# EAGLE design ionode_sunb (EAGLE 7.7.0)
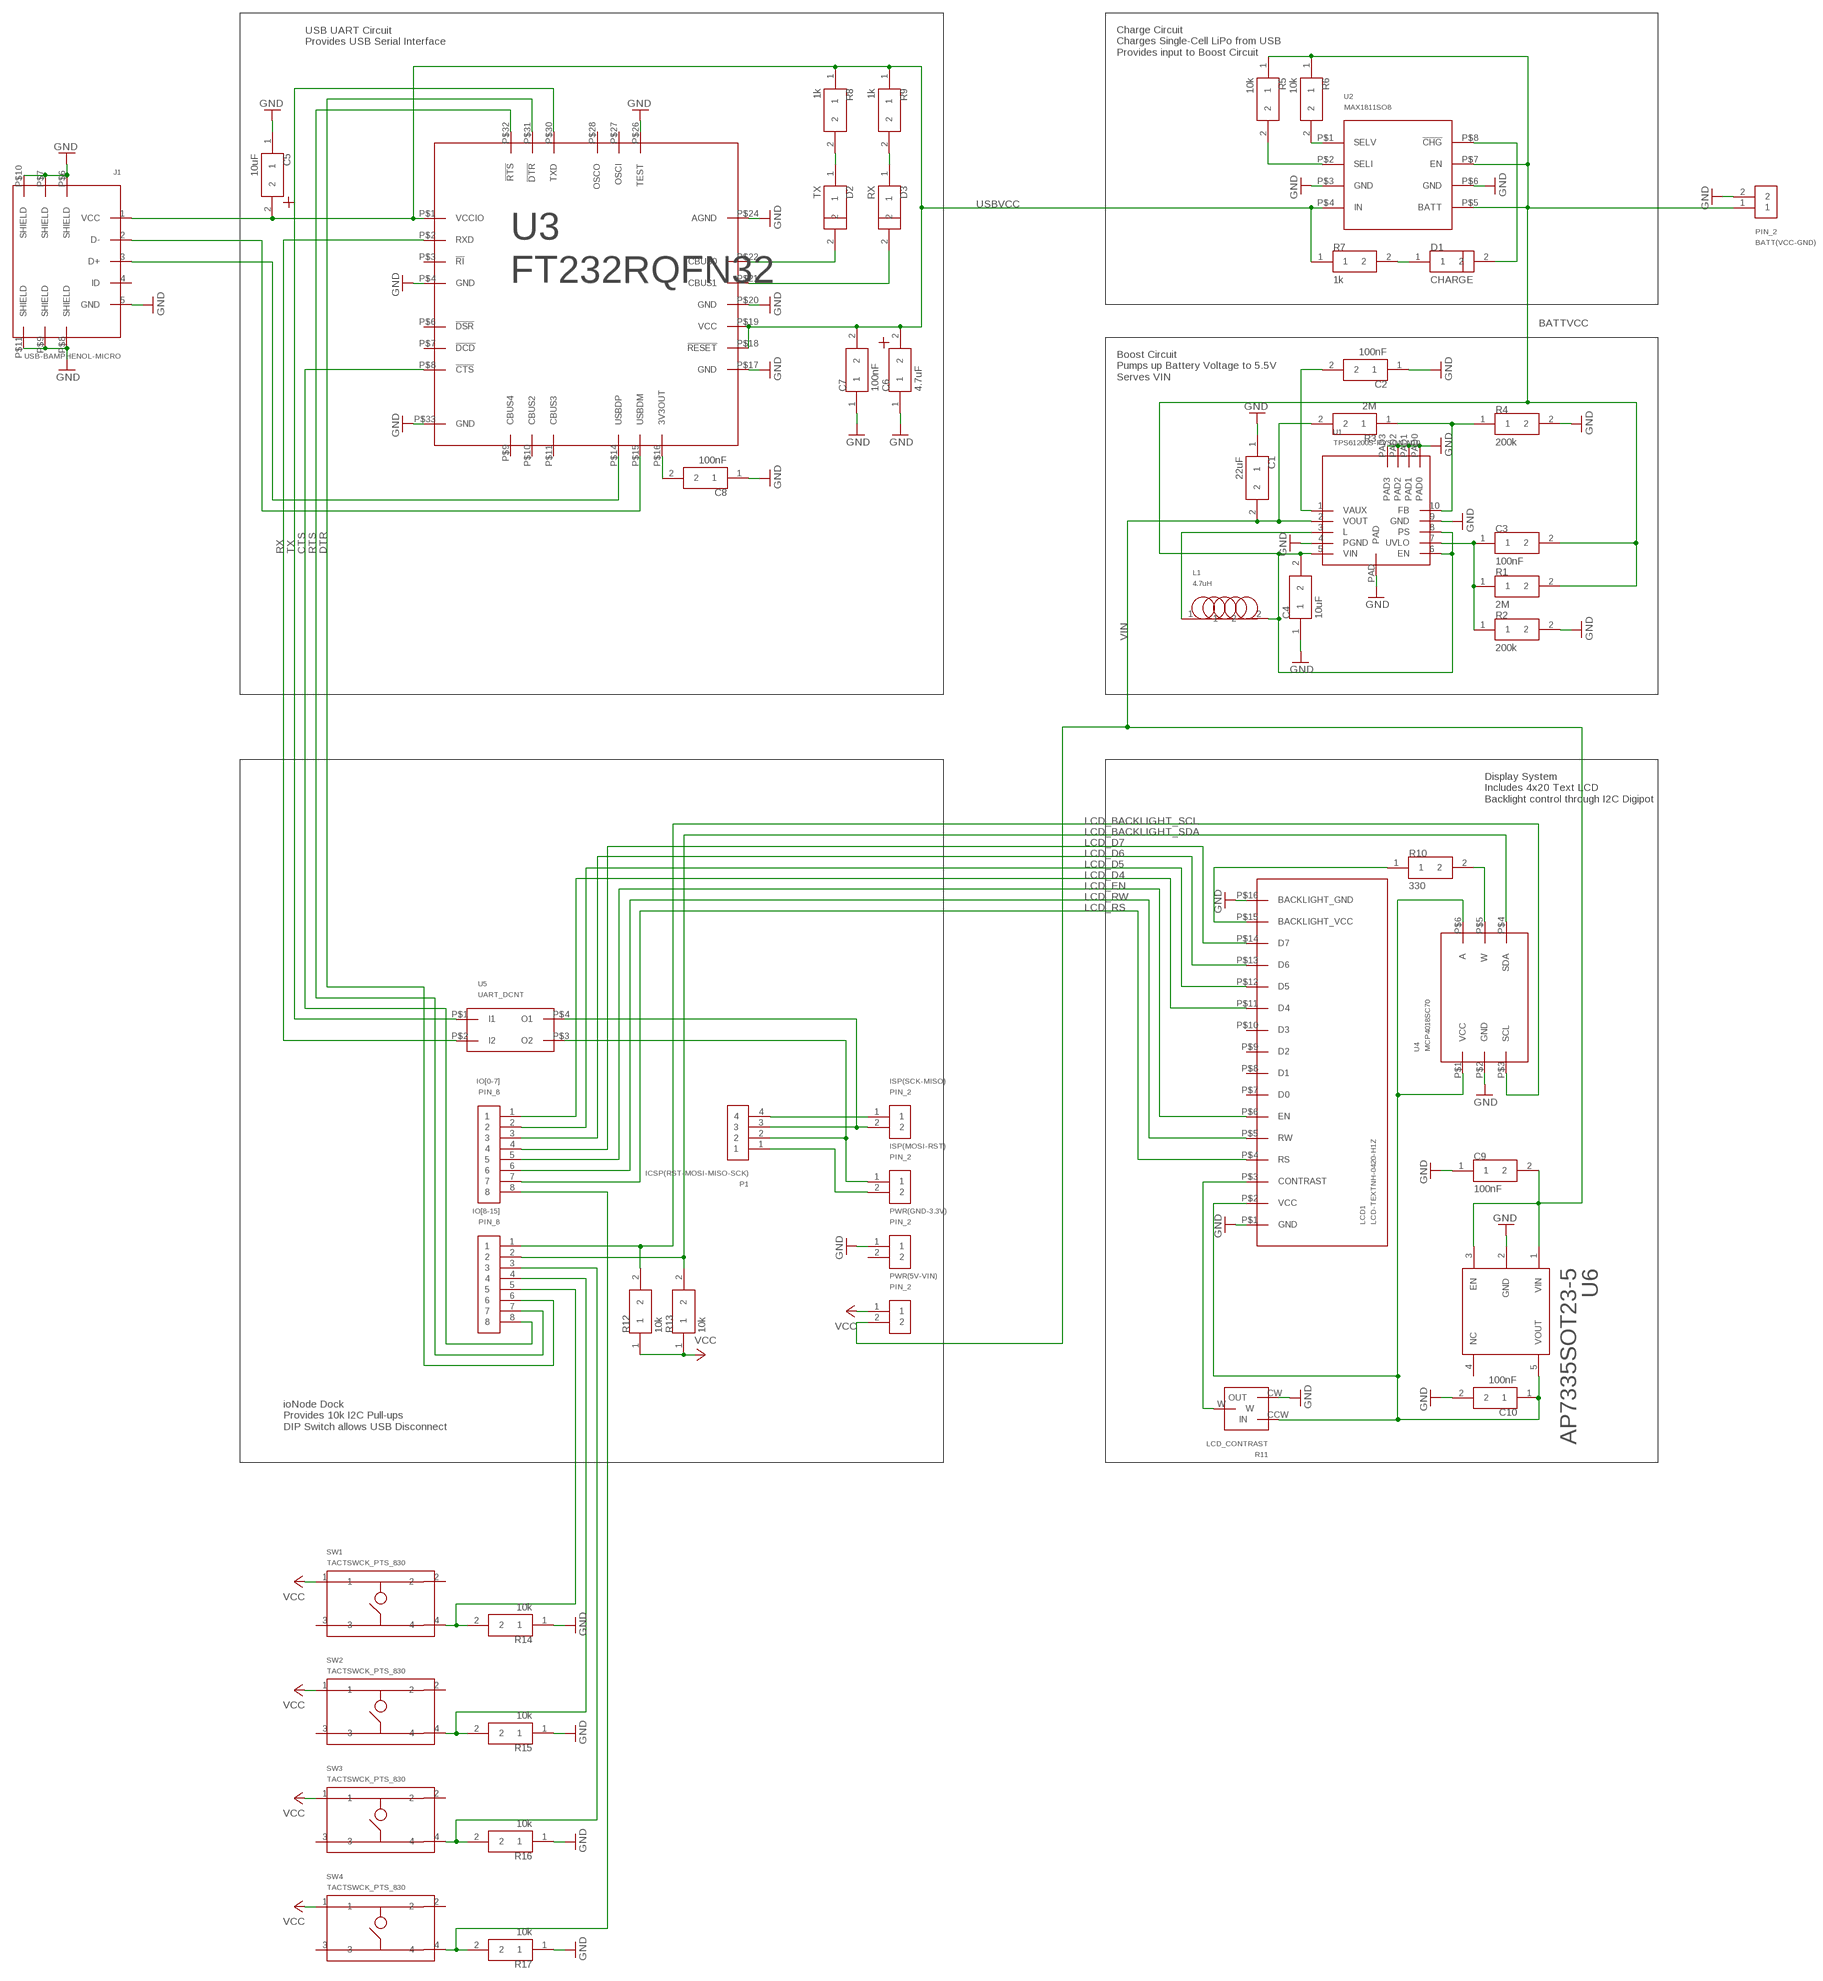
[diagram p0: schematic, sheet 1]

## Parts
BATT(VCC-GND)  PIN_2  [PIN_2]
C1  22uF  CAP1206  [1206]
C2  100nF  CAP0805  [0805]
C3  100nF  CAP0805  [0805]
C4  10uF  CAP0805  [0805]
C5  10uF  CAP_POLARIZEDSMD_RADIAL_43  [RADCAP_SMD_43]
C6  4.7uF  CAP_POLARIZEDSMD_RADIAL_43  [RADCAP_SMD_43]
C7  100nF  CAP0805  [0805]
C8  100nF  CAP0805  [0805]
C9  100nF  CAP0805  [0805]
C10  100nF  CAP0805  [0805]
D1  CHARGE  LED0805  [0805]
D2  TX  LED0805  [0805]
D3  RX  LED0805  [0805]
IO[0-7]  PIN_8  [PIN_8]
IO[8-15]  PIN_8  [PIN_8]
ISP(MOSI-RST)  PIN_2  [PIN_2]
ISP(SCK-MISO)  PIN_2  [PIN_2]
J1  USB-BAMPHENOL-MICRO  [AMPHENOL-USB-MICRO-B]
L1  4.7uH  INDSMD-3232  [IND-SMD-3232]
LCD1  LCD-TEXTNH-0420-H1Z  [LCD-NH-0420-H1Z]
P1  ICSP(RST-MOSI-MISO-SCK)  PIN_4  [PIN_4]
PWR(5V-VIN)  PIN_2  [PIN_2]
PWR(GND-3.3V)  PIN_2  [PIN_2]
R1  2M  RES0805  [0805]
R2  200k  RES0805  [0805]
R3  2M  RES0805  [0805]
R4  200k  RES0805  [0805]
R5  10k  RES0805  [0805]
R6  10k  RES0805  [0805]
R7  1k  RES0805  [0805]
R8  1k  RES0805  [0805]
R9  1k  RES0805  [0805]
R10  330  RES0805  [0805]
R11  LCD_CONTRAST  TRIMPOTBOURNS-3306F  [TRIMPOT-BOURNS-3306F]
R12  10k  RES0805  [0805]
R13  10k  RES0805  [0805]
R14  10k  RES0805  [0805]
R15  10k  RES0805  [0805]
R16  10k  RES0805  [0805]
R17  10k  RES0805  [0805]
SW1  TACTSWCK_PTS_830  [TACTSW_CK_PTS_830]
SW2  TACTSWCK_PTS_830  [TACTSW_CK_PTS_830]
SW3  TACTSWCK_PTS_830  [TACTSW_CK_PTS_830]
SW4  TACTSWCK_PTS_830  [TACTSW_CK_PTS_830]
U1  TPS61200S-PVSON-N10  [S-PVSON-N10]
U2  MAX1811SO8  [SO8]
U3  FT232RQFN32  [32-VQFN]
U4  MCP4018SC70  [SC-70]
U5  UART_DCNT  DIPSWITCH_2DIP  [DIPSWITCH_2]
U6  AP7335SOT23-5  [SOT23-5]

## Nets
BATTVCC: BATT(VCC-GND).1 C3.2 C4.2 L1.2 R1.2 R5.1 R6.1 U1.5(VIN) U1.6(EN) U1.8(PS) U2.P$5(BATT) U2.P$7(EN)
CTS: IO[8-15].8 U3.P$8(!CTS)
DTR: IO[8-15].6 U3.P$31(!DTR)
GND: BATT(VCC-GND).2 C1.1 C2.1 C4.1 C5.1 C6.1 C7.1 C8.1 C9.1 C10.2 J1.5(GND) J1.P$6(SHIELD) J1.P$7(SHIELD) J1.P$8(SHIELD) J1.P$9(SHIELD) J1.P$10(SHIELD) J1.P$11(SHIELD) LCD1.P$1(GND) LCD1.P$16(BACKLIGHT_GND) R2.2 R4.2 R11.CW(OUT) R14.1 R15.1 R16.1 R17.1 U1.4(PGND) U1.9(GND) U1.PAD U1.PAD0 U1.PAD1 U1.PAD2 U1.PAD3 U2.P$3(GND) U2.P$6(GND) U3.P$4(GND) U3.P$17(GND) U3.P$20(GND) U3.P$24(AGND) U3.P$26(TEST) U3.P$33(GND) U4.P$2(GND) U6.2(GND)
LCD_BACKLIGHT_SCL: IO[8-15].1 R12.2 U4.P$3(SCL)
LCD_BACKLIGHT_SDA: IO[8-15].2 R13.2 U4.P$4(SDA)
LCD_D4: IO[0-7].1 LCD1.P$11(D4)
LCD_D5: IO[0-7].2 LCD1.P$12(D5)
LCD_D6: IO[0-7].3 LCD1.P$13(D6)
LCD_D7: IO[0-7].4 LCD1.P$14(D7)
LCD_EN: IO[0-7].5 LCD1.P$6(EN)
LCD_RS: IO[0-7].7 LCD1.P$4(RS)
LCD_RW: IO[0-7].6 LCD1.P$5(RW)
LCDVCC: C10.1 LCD1.P$2(VCC) R11.CCW(IN) U4.P$1(VCC) U4.P$6(A) U6.5(VOUT)
N$1: ISP(MOSI-RST).1 P1.2 U5.P$3(O2)
N$2: R6.2 U2.P$1(SELV)
N$3: R3.1 R4.1 U1.10(FB)
N$4: C2.2 U1.1(VAUX)
N$5: L1.1 U1.3(L)
N$6: C3.1 R1.1 R2.1 U1.7(UVLO)
N$7: R10.2 U4.P$5(W)
N$8: R5.2 U2.P$2(SELI)
N$9: LCD1.P$15(BACKLIGHT_VCC) R10.1
N$10: D1.2 U2.P$8(!CHG)
N$11: D1.1 R7.2
N$12: LCD1.P$3(CONTRAST) R11.W
N$13: J1.2(D-) U3.P$15(USBDM)
N$14: J1.3(D+) U3.P$14(USBDP)
N$15: C8.2 U3.P$16(3V3OUT)
N$16: ISP(SCK-MISO).2 P1.3 U5.P$4(O1)
N$17: D2.2 U3.P$22(CBUS0)
N$18: D3.2 U3.P$21(CBUS1)
N$19: D2.1 R8.2
N$20: D3.1 R9.2
N$21: IO[8-15].5 R14.2 SW1.4
N$22: IO[8-15].4 R15.2 SW2.4
N$23: IO[8-15].3 R16.2 SW3.4
N$24: IO[0-7].8 R17.2 SW4.4
N$25: ISP(SCK-MISO).1 P1.4
N$26: ISP(MOSI-RST).2 P1.1
RTS: IO[8-15].7 U3.P$32(!RTS)
RX: U3.P$2(RXD) U5.P$2(I2)
TX: U3.P$30(TXD) U5.P$1(I1)
USBVCC: C5.2 C6.2 C7.2 J1.1(VCC) R7.1 R8.1 R9.1 U2.P$4(IN) U3.P$1(VCCIO) U3.P$18(!RESET) U3.P$19(VCC)
VCC: PWR(5V-VIN).1 R12.1 R13.1 SW1.1 SW2.1 SW3.1 SW4.1
VIN: C1.2 C9.2 PWR(5V-VIN).2 R3.2 U1.2(VOUT) U6.1(VIN) U6.3(EN)
Unconnected: J1.4(ID) LCD1.P$7(D0) LCD1.P$8(D1) LCD1.P$9(D2) LCD1.P$10(D3) PWR(GND-3.3V).1 PWR(GND-3.3V).2 SW1.2 SW1.3 SW2.2 SW2.3 SW3.2 SW3.3 SW4.2 SW4.3 U3.P$3(!RI) U3.P$6(!DSR) U3.P$7(!DCD) U3.P$9(CBUS4) U3.P$10(CBUS2) U3.P$11(CBUS3) U3.P$27(OSCI) U3.P$28(OSCO) U6.4(NC)

## Notes on the sheet
- USB UART Circuit
  Provides USB Serial Interface
- Charge Circuit
  Charges Single-Cell LiPo from USB
  Provides input to Boost Circuit
- Boost Circuit
  Pumps up Battery Voltage to 5.5V
  Serves VIN
- Display System
  Includes 4x20 Text LCD
  Backlight control through I2C Digipot
- ioNode Dock
  Provides 10k I2C Pull-ups
  DIP Switch allows USB Disconnect

## Library data of the parts
BATT(VCC-GND) ISP(MOSI-RST) ISP(SCK-MISO) PWR(5V-VIN) PWR(GND-3.3V) = dooba:PIN_2
C1-C4 C7-C10 = dooba:CAP
C5 C6 = dooba:CAP_POLARIZED
D1-D3 = dooba:LED
IO[0-7] IO[8-15] = dooba:PIN_8
J1 = dooba:USB-B
L1 = dooba:IND
LCD1 = dooba:LCD-TEXT
P1 = dooba:PIN_4
R1-R10 R12-R17 = dooba:RES
R11 = dooba:TRIMPOT
SW1-SW4 = dooba:TACTSW
U1 = dooba:TPS61200
U2 = dooba:MAX1811
U3 = dooba:FT232R
U4 = dooba:MCP4018
U5 = dooba:DIPSWITCH_2
U6 = dooba:AP7335

## Board
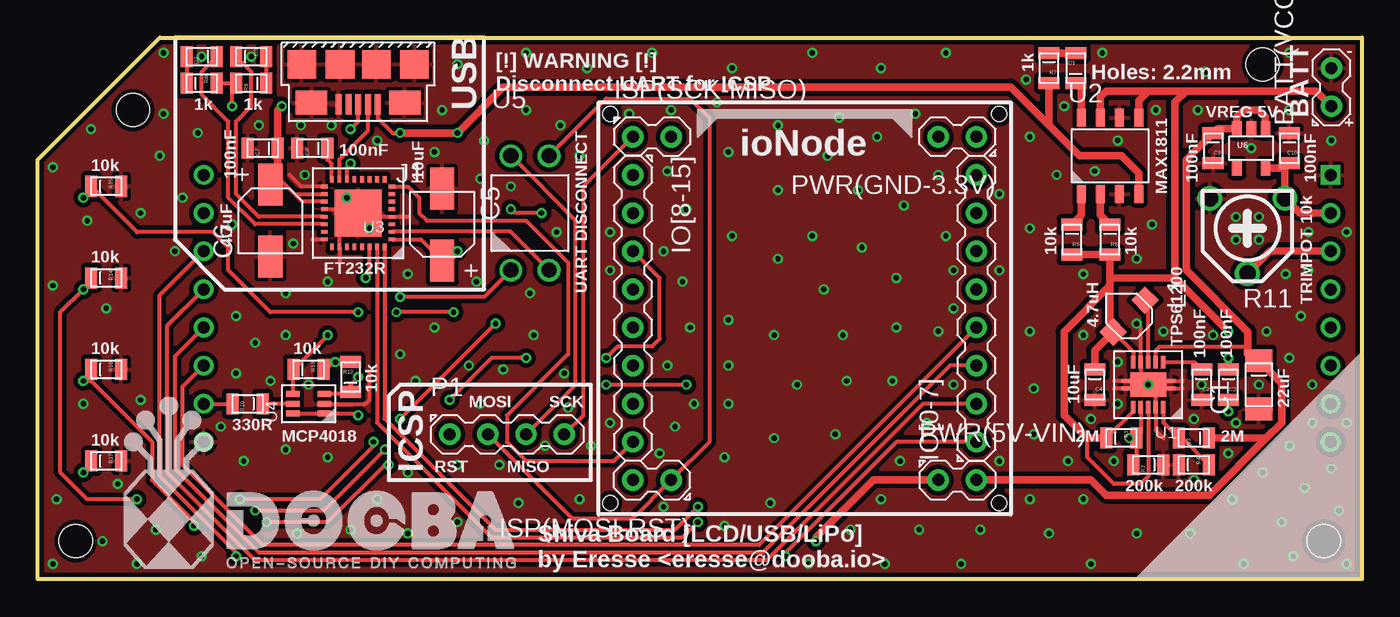
[diagram p1: board, top side]
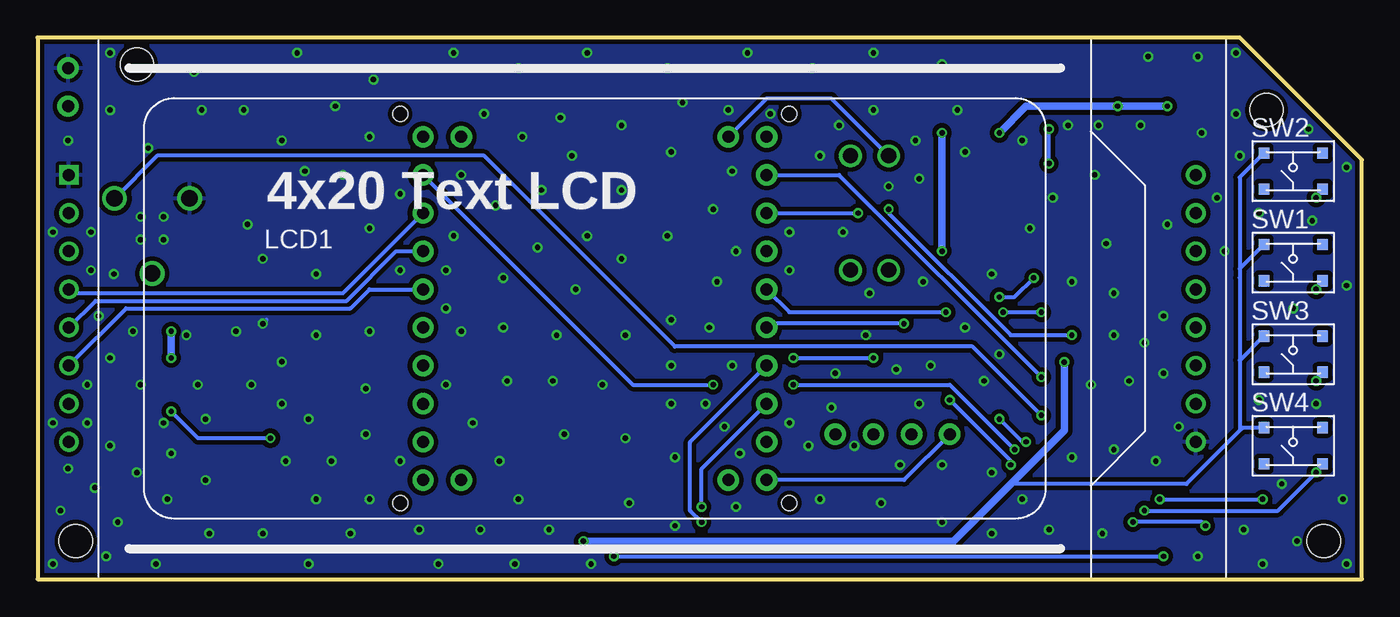
[diagram p2: board, bottom side, seen from below]

Size 88.14 x 36.07 mm. Coordinates in mm from the lower left corner, seen from the top.
Outline: 0,0 0,27.94 8.13,36.07 88.14,36.07 88.14,0 0,0
Copper layers (1*16): Top 0.035mm / dielectric 1.5mm / Bottom 0.035mm
Design rules "dooba *": minimum track width 6mil, minimum drill 12mil, track to track 6mil, track to pad 6mil, pad to pad 6mil, via to via 6mil, smd to smd 0mil, copper to edge 10mil, drill to drill 10mil, minimum pad ring 10mil, minimum via ring 6mil, stop-mask expansion 2mil, vias tented up to drill 25mil, thermal gap 10mil
Holes 1 mm at 64.01,5.08 38.1,5.08 64.01,30.99 38.1,30.99
Holes 2.2 mm at 6.35,31.24 2.54,2.54 85.6,2.54 81.53,34.29

### Footprints (pad centres in the part's own frame; a part is rotated, then mirrored left to right if it is on the bottom)
PIN_2 = drill 0.8 pad 1.422: 1 -1.27,0; 2 1.27,0
1206 = smd 1.524 x 1.778: 1 -1.6,0; 2 1.6,0
0805 = smd 0.8 x 1.4: 1 -1,0; 2 1,0
RADCAP_SMD_43 = smd 2.8 x 1.6: 1 -2.4,0; 2 2.4,0
PIN_8 = drill 0.8 pad 1.422: 1 -8.89,0; 2 -6.35,0; 3 -3.81,0; 4 -1.27,0; 5 1.27,0; 6 3.81,0; 7 6.35,0; 8 8.89,0
AMPHENOL-USB-MICRO-B = smd 0.4 x 1.35: 1 -1.3,2.675; 2 -0.65,2.675; 3 0,2.675; 4 0.65,2.675; 5 1.3,2.675 | smd 1.9 x 1.9: P$6 -1.2,0; P$7 1.2,0; P$8 -3.75,0; P$9 3.75,0 | smd 2.1 x 1.6: P$10 -3.1,2.55; P$11 3.1,2.55
IND-SMD-3232 = smd 1.3 x 1.3 rotated 315: 1 -1.061,1.061; 2 1.061,-1.061
LCD-NH-0420-H1Z = drill 0.8 square: P$1 -35,8.89 | drill 0.8: P$2 -35,6.35; P$3 -35,3.81; P$4 -35,1.27; P$5 -35,-1.27; P$6 -35,-3.81; P$7 -35,-6.35; P$8 -35,-8.89; P$9 40,8.89; P$10 40,6.35; P$11 40,3.81; P$12 40,1.27; P$13 40,-1.27; P$14 40,-3.81; P$15 40,-6.35; P$16 40,-8.89
PIN_4 = drill 0.8 pad 1.422: 1 -3.81,0; 2 -1.27,0; 3 1.27,0; 4 3.81,0
TRIMPOT-BOURNS-3306F = drill 1.1: CCW -2.5,-2.5; CW 2.5,-2.5; W 0,2.5
TACTSW_CK_PTS_830 = smd 0.7 x 0.75: 1 -1.95,1.2; 2 1.95,1.2; 3 -1.95,-1.2; 4 1.95,-1.2
S-PVSON-N10 = smd 0.3 x 0.85: 1 -1,-1.5; 2 -0.5,-1.5; 3 0,-1.5; 4 0.5,-1.5; 5 1,-1.5; 6 1,1.5; 7 0.5,1.5; 8 0,1.5; 9 -0.5,1.5; 10 -1,1.5 | smd 2.4 x 1.65: PAD 0,0 | smd 0.6 x 0.28: PAD0 -1.499,0.25; PAD1 -1.499,-0.25; PAD2 1.499,0.25; PAD3 1.499,-0.25
SO8 = smd 0.6 x 1.2: P$1 -1.905,-2.54; P$2 -0.635,-2.54; P$3 0.635,-2.54; P$4 1.905,-2.54; P$5 1.905,2.54; P$6 0.635,2.54; P$7 -0.635,2.54; P$8 -1.905,2.54
32-VQFN = smd 0.45 x 0.26: P$1 -2.25,1.75; P$2 -2.25,1.25; P$3 -2.25,0.75; P$4 -2.25,0.25; P$5 -2.25,-0.25; P$6 -2.25,-0.75; P$7 -2.25,-1.25; P$8 -2.25,-1.75; P$17 2.25,-1.75; P$18 2.25,-1.25; P$19 2.25,-0.75; P$20 2.25,-0.25; P$21 2.25,0.25; P$22 2.25,0.75; P$23 2.25,1.25; P$24 2.25,1.75 | smd 0.26 x 0.45: P$9 -1.75,-2.25; P$10 -1.25,-2.25; P$11 -0.75,-2.25; P$12 -0.25,-2.25; P$13 0.25,-2.25; P$14 0.75,-2.25; P$15 1.25,-2.25; P$16 1.75,-2.25; P$25 1.75,2.25; P$26 1.25,2.25; P$27 0.75,2.25; P$28 0.25,2.25; P$29 -0.25,2.25; P$30 -0.75,2.25; P$31 -1.25,2.25; P$32 -1.75,2.25 | smd 3.1 x 3.1: P$33 0,0
SC-70 = smd 0.4 x 0.9: P$1 -0.65,-1.05; P$2 0,-1.05; P$3 0.65,-1.05; P$4 0.65,1.05; P$5 0,1.05; P$6 -0.65,1.05
DIPSWITCH_2 = drill 1: P$1 -1.27,-3.81; P$2 1.27,-3.81; P$3 1.27,3.81; P$4 -1.27,3.81
SOT23-5 = smd 0.66 x 1: 1 0.95,1.315; 2 0,1.315; 3 -0.95,1.315; 4 -0.95,-1.315; 5 0.95,-1.315

### Placement (x,y rotation side)
BATT(VCC-GND)  86.11,32.77 90 top
C1  81.28,12.95 90 top
C2  77.47,12.95 90 top
C3  79.25,12.95 90 top
C4  70.36,12.95 90 top
C5  26.92,23.62 270 top
C6  15.49,23.88 90 top
C7  14.99,28.7 0 top
C8  18.29,28.7 0 top
C9  78.23,28.7 90 top
C10  83.31,28.7 90 top
D1  69.09,34.04 270 top
D2  10.92,34.8 0 top
D3  14.22,34.8 180 top
IO[0-7]  62.48,18.03 90 top
IO[8-15]  39.62,18.03 270 top
ISP(MOSI-RST)  40.89,6.6 180 top
ISP(SCK-MISO)  40.89,29.46 0 top
J1  21.34,34.29 180 top
L1  72.64,17.53 270 top
LCD1  51.05,18.03 0 bottom
P1  31.24,9.65 0 top
PWR(5V-VIN)  61.21,6.6 0 top
PWR(GND-3.3V)  61.21,29.46 180 top
R1  72.14,9.4 180 top
R2  73.91,7.62 0 top
R3  76.96,9.4 0 top
R4  76.96,7.62 180 top
R5  71.37,22.61 90 top
R6  68.83,22.61 90 top
R7  67.31,34.04 90 top
R8  10.92,33.02 180 top
R9  14.22,33.02 0 top
R10  13.97,11.68 0 top
R11  80.52,22.86 180 top
R12  20.83,13.46 270 top
R13  18.03,13.97 180 top
R14  4.57,20.07 180 top
R15  4.57,26.16 180 top
R16  4.57,13.97 180 top
R17  4.57,7.87 180 top
SW1  4.57,21.08 0 bottom
SW2  4.57,27.18 0 bottom
SW3  4.57,14.99 0 bottom
SW4  4.57,8.89 0 bottom
U1  73.91,12.95 180 top
U2  71.37,28.19 0 top
U3  21.34,24.38 180 top
U4  18.03,11.68 90 top
U5  32.77,24.38 0 top
U6  80.77,28.7 0 top

### Tracks (layer width: path | path; a pad name or v marks a point on that pad's centre or on a via)
BATTVCC  (via drill 0.36)
  Top 0.254: L1.2 72.91,15.13 U1.5 | U1.8 73.91,6.86 73.41,6.35 71.63,6.35 69.85,8.13 69.85,9.4 | U1.6 72.91,11.18 R1.2
  Top 0.508: U2.P$7 70.74,32.13 71.12,32.51 73.91,32.51 | U2.P$5 73.28,31.88 73.91,32.51 | R6.1 R5.1 71.37,20.07 | 71.37,20.07 71.37,19.56 | 71.37,19.56 71.37,16.67 L1.2 70.36,15.24 C4.2 | 71.37,19.56 68.33,16.51 68.33,10.92 69.85,9.4 R1.2 | C3.2 v79.25,14.73 | v79.25,16.51 75.69,20.07 | 75.69,20.07 71.37,20.07 | 73.91,32.51 76.45,32.51 | 76.45,32.51 85.09,32.51 BATT(VCC-GND).1 | 75.69,20.07 75.69,31.75 76.45,32.51
  Bottom 0.508: v79.25,14.73 v79.25,16.51
CTS
  Top 0.254: U3.P$8 24.67,26.13 25.4,25.4 25.4,24.38 25.91,23.88 32.51,23.88 35.31,21.08 35.31,14.99 31.24,10.92 31.24,9.14 32.51,7.87 38.35,7.87 IO[8-15].8
DTR  (via drill 0.36)
  Top 0.254: U3.P$31 22.59,10.43 30.23,2.79 42.93,2.79 v43.94,3.81
  Bottom 0.254: v43.94,3.81 44.7,4.57 44.7,9.14 IO[8-15].6
GND  (via drill 0.36)
  Top 0.254: 74.41,12.45 U1.9 74.41,9.91 74.93,9.4 | 74.41,12.45 U1.PAD | 76.2,12.7 U1.PAD0 74.66,12.7 74.41,12.45 | U1.PAD1 76.2,13.2 76.2,13.21 | U1.PAD3 71.63,13.2 71.63,13.21 | 71.63,12.7 U1.PAD2 73.66,12.7 U1.PAD | U1.PAD 73.41,13.45 U1.4 73.41,16.76 v73.15,17.02 | U3.P$20 20.07,24.63 | 20.07,24.63 21.34,24.63 21.84,24.13 21.85,24.13 U3.P$4 24.63,24.13 24.64,24.13 | U3.P$33 20.09,23.13 U3.P$26 20.09,21.1 20.07,21.08 | 20.07,25.65 20.07,24.63 | U3.P$17 17.55,26.13 16.76,26.92 | U3.P$24 18.32,22.63 18.29,22.61 | U4.P$2 21.84,11.68 22.1,11.94 22.1,13.72
  Bottom 0.254: v73.15,17.02 72.9,17.27
  other vias: 8.38,35.05 1.02,27.43 1.02,1.02 87.12,1.02 8.38,30.99 3.56,29.97 10.67,29.72 4.57,18.03 9.14,21.84 12.95,23.62 16.51,19.05 19.3,19.81 24.64,20.32 29.21,19.81 32.77,19.05 26.42,16.76 25.15,13.21 28.7,14.22 30.99,13.97 16.51,16.26 19.3,8.13 16.51,8.64 13.72,7.87 13.21,13.72 13.21,17.53 6.86,11.94 3.05,11.68 5.33,6.35 6.86,24.38 3.3,23.88 1.02,19.56 8.13,28.19 9.65,25.4 17.02,22.35 1.27,5.33 4.32,2.54 10.92,1.52 17.27,3.05 20.83,3.3 24.64,3.05 22.61,5.33 24.64,7.11 27.94,3.81 27.94,7.62 32,5.08 30.73,7.62 36.07,5.33 41.4,8.38 41.66,4.83 45.72,3.56 48.77,5.08 45.72,8.13 38.1,10.41 29.46,11.68 35.31,11.43 33.78,8.89 36.83,8.89 35.05,13.72 33.02,16.26 17.78,26.92 20.57,25.4 22.1,23.37 14.73,30.23 17.53,30.23 19.56,30.23 22.61,29.21 26.42,28.45 29.46,26.67 31.5,26.16 29.72,29.21 32.51,31.24 26.92,31.24 14.22,34.8 10.92,34.8 27.94,34.29 34.8,30.23 36.07,28.19 39.37,30.99 41.91,27.18 42.16,31.24 32.51,35.05 40.89,35.05 38.1,23.11 38.1,20.57 34.54,23.11 41.91,14.22 43.43,16.76 41.66,21.84 43.18,24.64 42.93,19.81 45.97,17.27 45.97,28.45 46.23,22.86 49.28,25.91 49.28,21.34 51.56,22.86 54.61,25.91 52.58,28.19 55.88,29.46 49.28,30.23 59.94,26.92 57.66,24.89 54.86,22.1 52.32,19.3 49.02,16.26 45.97,14.22 42.42,10.16 43.69,11.68 45.97,11.68 60.45,22.86 60.96,20.57 60.96,18.03 59.94,16.51 56.9,13.21 53.09,9.65 49.02,9.4 50.55,12.95 53.59,16.26 57.15,20.07 57.15,16.76 53.85,13.21 59.18,10.41 60.96,12.95 57.4,7.87 56.13,5.33 54.1,3.3 51.31,1.02 58.67,3.3 56.39,1.02 61.47,1.02 62.74,3.3 67.31,3.05 70.1,1.02 73.15,3.05 68.58,7.87 64.01,7.87 66.29,12.7 66.29,9.65 66.04,16.51 64.01,20.57 67.82,26.92 66.04,23.37 69.6,20.32 73.15,21.34 74.17,23.62 74.42,31.24 71.88,29.21 70.36,27.18 66.04,29.46 58.42,30.99 53.34,30.73 45.21,31.75 51.56,35.05 60.45,35.05 65.79,33.27 68.33,31.5 70.87,35.05 83.31,35.05 77.72,33.78 56.13,34.04 46.23,34.04 36.58,34.04 77.22,31.24 83.31,31.24 86.11,29.21 81.28,22.61 79.76,24.13 79.76,22.61 81.28,24.13 84.58,23.11 87.12,23.11 74.93,16.51 78.23,16.26 81.79,16.51 83.31,14.73 84.84,12.95 84.84,10.41 83.31,8.89 76.96,10.67 70.1,10.67 71.88,11.68 71.88,14.48 69.6,16.26 71.63,7.87 76.96,6.6 79.25,8.38 79.76,10.41 81.28,12.95 77.47,12.95 73.91,12.95 69.6,5.33 66.04,5.33 79.5,5.33 81.53,7.11 83.06,20.32 84.58,20.57 84.07,17.53 87.12,10.41 86.11,7.37 86.61,4.57 82.8,3.81 76.71,3.05 80.26,1.02 83.57,1.52 84.33,6.1 7.87,3.3 6.6,1.02 14.48,15.75 24.13,14.99 18.03,12.95 15.49,13.21 12.19,10.16 64.01,25.65 80.77,28.7
  pour Top (isolate 0.305): 0,27.94 8.13,36.07 88.14,36.07 88.14,0 0,0
  pour Bottom (isolate 0.305): 8.13,36.07 88.14,36.07 88.14,0 0,0 0,27.94
LCD_BACKLIGHT_SCL  (via drill 0.36)
  Top 0.254: v21.34,13.46 20.83,12.95 R12.2 20.7,12.33 U4.P$3
  Bottom 0.254: IO[8-15].1 34.8,26.92 v21.34,13.46
LCD_BACKLIGHT_SDA  (via drill 0.36)
  Top 0.254: v33.53,24.38 31.75,24.38 v31.5,24.64 | v19.3,16.26 19.3,16.24 R13.2 16.98,13.92 U4.P$4
  Bottom 0.254: IO[8-15].2 v33.53,24.38 | v31.5,24.64 31.5,24.38 23.37,16.26 v19.3,16.26
LCD_D4  (via drill 0.36)
  Top 0.254: IO[0-7].1 57.15,9.14 49.78,1.78 v49.78,1.52 | v13.21,1.52 13.21,1.78 8.13,6.86 8.13,18.92 LCD1.P$11
  Bottom 0.254: v49.78,1.52 v13.21,1.52
LCD_D5
  Top 0.254: IO[0-7].2 58.93,11.68 48.51,1.27 14.48,1.27 8.64,7.11 8.64,16.89 LCD1.P$12
LCD_D6
  Top 0.254: IO[0-7].3 60.71,14.22 48.26,1.78 14.73,1.78 9.14,7.37 9.14,14.85 LCD1.P$13
LCD_D7
  Top 0.254: IO[0-7].4 48.01,2.29 14.99,2.29 9.65,7.62 9.65,12.82 LCD1.P$14
LCD_EN
  Bottom 0.254: LCD1.P$6 82.24,18.03 67.31,18.03 66.04,19.3 IO[0-7].5
LCD_RS
  Bottom 0.254: IO[0-7].7 67.82,19.05 85.8,19.05 LCD1.P$4
LCD_RW
  Bottom 0.254: LCD1.P$5 84.28,18.54 67.56,18.54 64.26,21.84 IO[0-7].6
LCDVCC  (via drill 0.36)
  Top 0.254: U4.P$6 U4.P$1 21.22,11.03 v21.34,10.92
  Top 0.508: C10.1 83,27.39 | 83,27.39 U6.5 | 83,27.39 83.02,27.37 R11.CCW 83.99,24.38 LCD1.P$2
  Bottom 0.254: v21.34,10.92 25.91,15.49 45.72,15.49 58.42,28.19 80.18,28.19 R11.CCW
N$1
  Top 0.254: U5.P$3 37.85,32 43.43,32 44.7,30.73 44.7,9.14 ISP(MOSI-RST).1 39.62,4.06 35.56,4.06 P1.2
N$2
  Top 0.508: U2.P$1 69.47,24.24 R6.2
N$3
  Top 0.254: U1.10 74.91,10.45 R3.1 76.18,9.4 R4.1
N$4
  Top 0.254: U1.1 76.97,14.45 C2.2
N$5
  Top 0.254: U1.3 73.91,18.38 L1.1
N$6  (via drill 0.36)
  Top 0.254: U1.7 73.41,9.68 R1.1 | R1.1 73.14,7.84 R2.1 | C3.1 v79.25,11.18 | v72.64,9.4 R1.1
  Bottom 0.254: v79.25,11.18 77.47,9.4 v72.64,9.4
N$7
  Top 0.254: U4.P$5 R10.2
N$8
  Top 0.508: U2.P$2 70.74,24.24 R5.2
N$9
  Top 0.254: LCD1.P$15 R10.1
N$10
  Top 0.508: U2.P$8 69.47,32.66 D1.2
N$11
  Top 0.508: R7.2 D1.1
N$12
  Top 0.508: LCD1.P$3 82,21.84 R11.W
N$13
  Top 0.254: U3.P$15 20.09,27.96 21.99,29.86 J1.2
N$14  (via drill 0.36)
  Top 0.254: U3.P$14 20.59,27.44 v20.83,27.69 | v20.83,29.97 21.34,30.48 J1.3
  Bottom 0.254: v20.83,27.69 v20.83,29.97
N$15
  Top 0.254: U3.P$16 19.59,27.66 19.3,27.94 19.3,28.69 C8.2
N$16
  Top 0.254: U5.P$4 35.81,23.88 35.81,12.95 P1.3
  Bottom 0.254: U5.P$4 35.31,32 39.62,32 ISP(SCK-MISO).2
N$17
  Top 0.254: U3.P$22 14.47,23.63 12.7,25.4 12.7,30.48 10.92,32.26 10.92,33.78 11.92,34.78 D2.2
N$18
  Top 0.254: U3.P$21 14.73,24.13 13.21,25.65 13.21,30.48 14.22,31.5 14.22,33.78 13.22,34.78 D3.2
N$19
  Top 0.254: D2.1 R8.2
N$20
  Top 0.254: D3.1 R9.2
N$21  (via drill 0.36)
  Top 0.254: R14.2 3.57,19.83 v3.05,19.3 1.52,17.78 1.52,7.11 3.3,5.33 v6.6,5.33 | v30.48,17.02 v24.13,10.67 | v13.46,5.33 18.8,5.33 22.35,8.89 v22.35,9.14
  Bottom 0.254: SW1.4 3.05,19.46 v3.05,19.3 | v13.46,5.33 v6.6,5.33 | v24.13,10.67 22.61,9.14 v22.35,9.14 | v30.48,17.02 39.37,17.02 IO[8-15].5
N$22  (via drill 0.36)
  Top 0.254: v3.05,25.4 3.57,25.92 R15.2 6.62,23.11 11.68,23.11 12.7,22.1 12.7,20.57 15.49,17.78 v21.34,17.78 | v27.69,17.78 v23.88,17.78
  Bottom 0.254: SW2.4 3.05,25.55 v3.05,25.4 | IO[8-15].4 38.1,17.78 v27.69,17.78 | v23.88,17.78 v21.34,17.78
N$23  (via drill 0.36)
  Top 0.254: R16.2 3.57,13.73 v3.05,13.21 3.56,13.21 7.62,9.14 7.62,6.6 10.41,3.81 v10.41,3.56 | v15.24,3.81 19.3,3.81 23.11,7.62 v23.37,7.62 | v27.43,11.94 30.23,14.73 v32.51,14.73 | IO[8-15].3 41.4,20.07 41.4,16 40.89,15.49 38.61,15.49 v37.85,14.73
  Bottom 0.254: SW3.4 3.05,13.36 v3.05,13.21 | v10.41,3.56 10.67,3.81 v15.24,3.81 | v23.37,7.62 23.37,7.87 v27.43,11.94 | v37.85,14.73 v32.51,14.73
N$24  (via drill 0.36)
  Top 0.254: v3.05,7.11 3.57,7.64 R17.2 | v43.18,12.95 v37.85,12.95 | v23.11,8.64 19.05,4.57 v14.48,4.57
  Bottom 0.254: SW4.4 3.05,7.26 v3.05,7.11 5.59,4.57 v14.48,4.57 | IO[0-7].8 48.51,12.95 v43.18,12.95 | v37.85,12.95 27.43,12.95 v23.11,8.64
N$25
  Top 0.254: P1.4 36.32,10.92 36.32,26.16 ISP(SCK-MISO).1
N$26
  Bottom 0.254: P1.1 30.48,6.6 ISP(MOSI-RST).2
RTS  (via drill 0.36)
  Top 0.254: U3.P$32 23.09,10.7 30.48,3.3 42.42,3.3 v43.94,4.83
  Bottom 0.254: v43.94,4.83 43.94,7.37 IO[8-15].7
RX
  Top 0.254: U5.P$2 31.48,23.13 U3.P$2
TX  (via drill 0.36)
  Top 0.254: U5.P$1 29.72,18.8 v24.13,18.8 | U3.P$30 22.09,20.31 v21.84,20.07
  Bottom 0.254: v21.84,20.07 23.11,18.8 v24.13,18.8
USBVCC  (via drill 0.36)
  Top 0.254: R8.1 R9.1 12.95,32.75 v12.95,31.5 | J1.1 22.64,30.7 23.62,29.72 v24.13,29.72 | 15.99,26.77 17.12,25.63 | 17.12,25.63 U3.P$18 | U3.P$19 17.62,25.13 17.12,25.63 | U3.P$1 25.51,22.63 C5.2
  Top 0.508: U2.P$4 73.28,27.05 72.14,28.19 69.34,28.19 67.31,30.23 | 67.31,30.23 R7.1 | v24.13,29.72 v27.94,29.72 30.99,32.77 64.77,32.77 67.31,30.23 | C6.2 15.99,26.77 C7.2 15.99,31.23 v16.26,31.5 | C5.2 27.32,21.22 v27.94,21.84
  Bottom 0.508: v24.13,29.72 22.35,31.5 v16.26,31.5 v12.95,31.5 | v27.94,21.84 v27.94,29.72
VCC  (via drill 0.36)
  Top 0.508: R13.1 19.53,14.46 v19.81,14.46 R12.1 | PWR(5V-VIN).1 55.63,6.6 51.82,2.79 v51.82,2.54
  Bottom 0.254: SW2.1 8.13,26.77 8.13,20.68 | 8.13,14.58 8.13,20.07 8.13,20.68 | 8.13,14.58 8.13,9.91 | 8.13,9.91 11.68,6.35 23.37,6.35 | SW4.1 7.94,10.09 8.13,9.91 | SW3.1 8.13,14.58 | SW1.1 8.13,20.68
  Bottom 0.508: v51.82,2.54 27.18,2.54 23.37,6.35 19.81,9.91 v19.81,14.46
VIN
  Top 0.254: U1.2 74.41,15.23 74.68,15.49 80.34,15.49 80.56,15.28 C1.2
  Top 0.508: C1.2 82.8,13.03 82.8,10.41 81.79,9.4 | 81.79,9.4 R3.2 | PWR(5V-VIN).2 70.1,6.6 71.12,5.59 77.98,5.59 81.79,9.4 | 81.28,14.48 81.03,14.48 80.52,14.99 80.52,15.24 80.56,15.28 80.56,16.47 76.45,20.57 76.45,27.92 C9.2 78.55,30.02 U6.3 79.82,30.8 80.26,31.24 81.28,31.24 81.72,30.8 U6.1

### Text on the board
tPlace: - | 1k | Holes: 2.2mm | [!] WARNING [!] / Disconnect UART for ICSP | 1k | 1k | USB | VREG 5V | BATT | + | 10uF | 100nF | ioNode | 10k | 100nF | 100nF | 100nF | MAX1811 | 4.7uF | 10k | 10k | 10k | FT232R | UART DISCONNECT | TRIMPOT 10k | 4.7uH | 10k | 10k | TPS61200 | 100nF | 100nF | 10k | MOSI | SCK | 10uF | 22uF | 330R | 10k | MCP4018 | 2M | 2M | ICSP | RST | MISO | 200k | 200k | Shiva Board [LCD/USB/LiPo] / by Eresse <eresse@dooba.io>
bPlace: 4x20 Text LCD